# Altium schematic sheet Harness_Wrapper.SchDoc
size A4
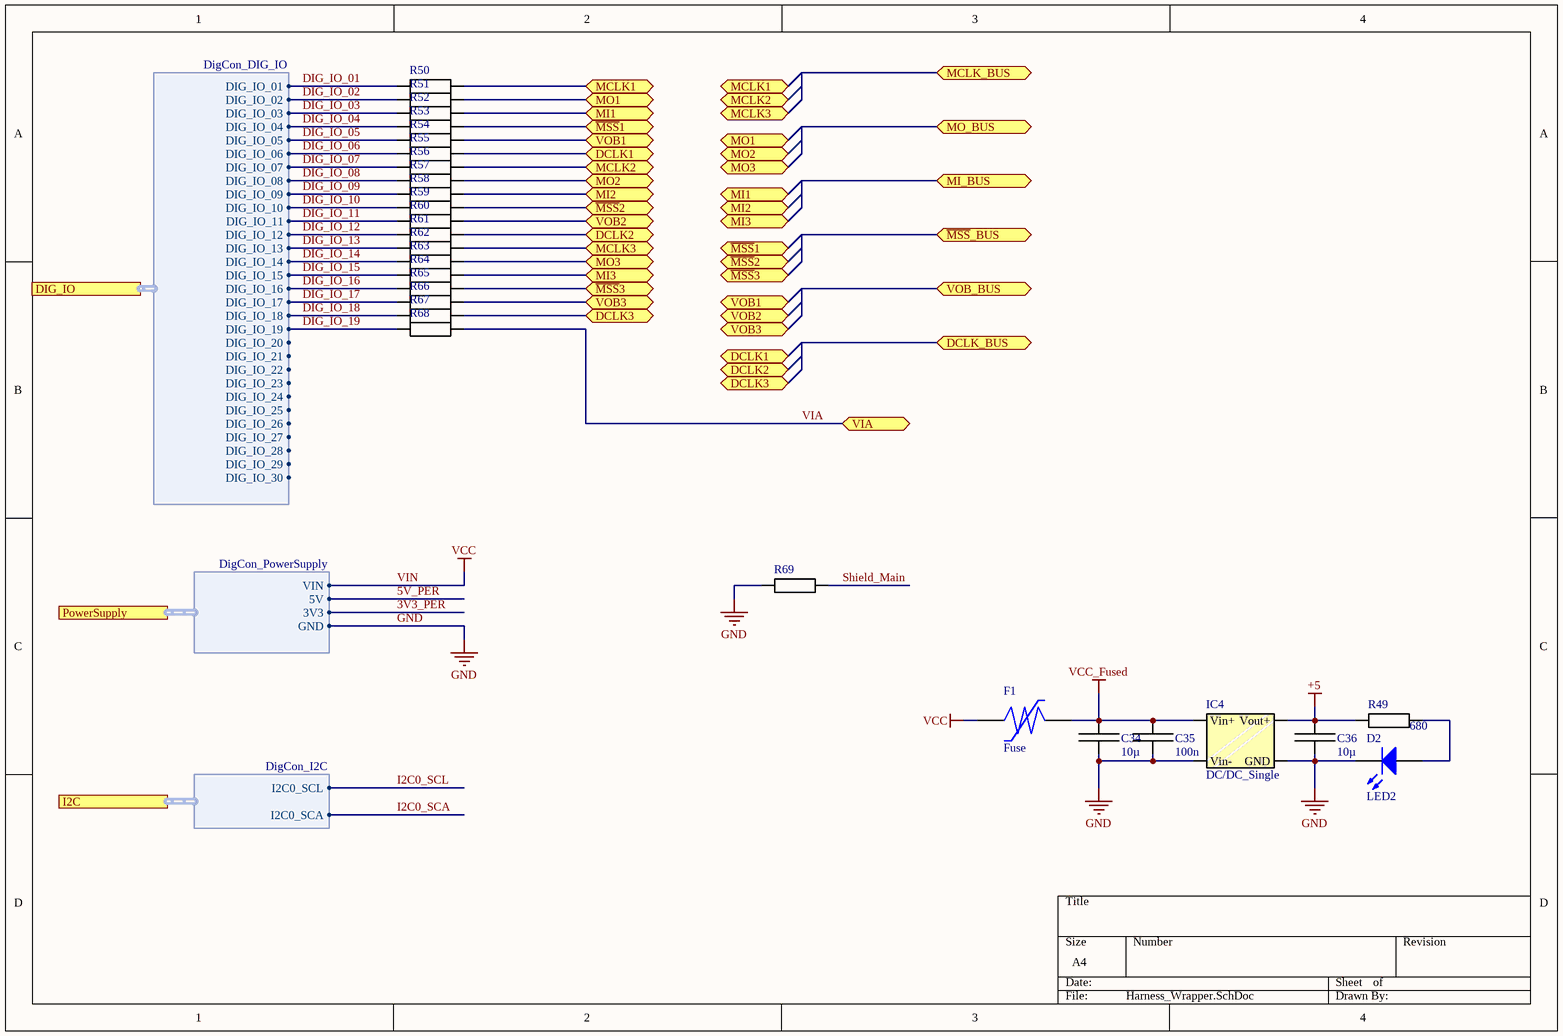
[diagram p0: Harness_Wrapper.SchDoc]

## Parts
C34  10µ  [RLC_0805]
C35  100n  [RLC_0805]
C36  10µ  [RLC_0805]
D2  LED2  [3.2X1.6X1.1]
F1  Fuse  [RLC_1812]
IC4  DC/DC_Single  [SIP4DCDC]
R49  680  [RLC_0805]
R50  100  [RLC_0805]  (value not drawn)
R51  100  [RLC_0805]  (value not drawn)
R52  100  [RLC_0805]  (value not drawn)
R53  100  [RLC_0805]  (value not drawn)
R54  100  [RLC_0805]  (value not drawn)
R55  100  [RLC_0805]  (value not drawn)
R56  100  [RLC_0805]  (value not drawn)
R57  100  [RLC_0805]  (value not drawn)
R58  100  [RLC_0805]  (value not drawn)
R59  100  [RLC_0805]  (value not drawn)
R60  100  [RLC_0805]  (value not drawn)
R61  100  [RLC_0805]  (value not drawn)
R62  100  [RLC_0805]  (value not drawn)
R63  100  [RLC_0805]  (value not drawn)
R64  100  [RLC_0805]  (value not drawn)
R65  100  [RLC_0805]  (value not drawn)
R66  100  [RLC_0805]  (value not drawn)
R67  100  [RLC_0805]  (value not drawn)
R68  100  [RLC_0805]  (value not drawn)
R69  0  [RLC_0805]  (value not drawn)

## Ports
DCLK1 (bidir), DCLK2 (bidir), DCLK3 (bidir), DCLK_BUS (bidir), DIG_IO (harness DigCon_DIG_IO), I2C (harness DigCon_I2C), MCLK1 (bidir), MCLK2 (bidir), MCLK3 (bidir), MCLK_BUS (bidir), MI1 (bidir), MI2 (bidir), MI3 (bidir), MI_BUS (bidir), MO1 (bidir), MO2 (bidir), MO3 (bidir), MO_BUS (bidir), PowerSupply (harness DigCon_PowerSupply), VIA (bidir), VOB1 (bidir), VOB2 (bidir), VOB3 (bidir), VOB_BUS (bidir), ~{MSS}1 (bidir), ~{MSS}2 (bidir), ~{MSS}3 (bidir), ~{MSS}_BUS (bidir)

## Harnesses
DigCon_DIG_IO: DIG_IO_01, DIG_IO_02, DIG_IO_03, DIG_IO_04, DIG_IO_05, DIG_IO_06, DIG_IO_07, DIG_IO_08, DIG_IO_09, DIG_IO_10, DIG_IO_11, DIG_IO_12, DIG_IO_13, DIG_IO_14, DIG_IO_15, DIG_IO_16, DIG_IO_17, DIG_IO_18, DIG_IO_19, DIG_IO_20, DIG_IO_21, DIG_IO_22, DIG_IO_23, DIG_IO_24, DIG_IO_25, DIG_IO_26, DIG_IO_27, DIG_IO_28, DIG_IO_29, DIG_IO_30
DigCon_PowerSupply: GND, 3V3, 5V, VIN
DigCon_I2C: I2C0_SCA, I2C0_SCL

## Nets
+5: C36.1 IC4.6(Vout+) R49.1
GND: C34.2 C35.2 C36.2 D2.2(K) IC4.2(Vin-) IC4.4(GND) R69.1 ; port PowerSupply.GND
VCC_Fused: C34.1 C35.1 F1.2 IC4.1(Vin+)
VIN: F1.1 ; port PowerSupply.VIN  [also labelled VCC]
3V3_PER: port PowerSupply.3V3
5V_PER: port PowerSupply.5V
DCLK1: R55.2 ; port DCLK1
DCLK2: R61.2 ; port DCLK2
DCLK3: R67.2 ; port DCLK3
DIG_IO_01: R50.1 ; port DIG_IO.DIG_IO_01
DIG_IO_02: R51.1 ; port DIG_IO.DIG_IO_02
DIG_IO_03: R52.1 ; port DIG_IO.DIG_IO_03
DIG_IO_04: R53.1 ; port DIG_IO.DIG_IO_04
DIG_IO_05: R54.1 ; port DIG_IO.DIG_IO_05
DIG_IO_06: R55.1 ; port DIG_IO.DIG_IO_06
DIG_IO_07: R56.1 ; port DIG_IO.DIG_IO_07
DIG_IO_08: R57.1 ; port DIG_IO.DIG_IO_08
DIG_IO_09: R58.1 ; port DIG_IO.DIG_IO_09
DIG_IO_10: R59.1 ; port DIG_IO.DIG_IO_10
DIG_IO_11: R60.1 ; port DIG_IO.DIG_IO_11
DIG_IO_12: R61.1 ; port DIG_IO.DIG_IO_12
DIG_IO_13: R62.1 ; port DIG_IO.DIG_IO_13
DIG_IO_14: R63.1 ; port DIG_IO.DIG_IO_14
DIG_IO_15: R64.1 ; port DIG_IO.DIG_IO_15
DIG_IO_16: R65.1 ; port DIG_IO.DIG_IO_16
DIG_IO_17: R66.1 ; port DIG_IO.DIG_IO_17
DIG_IO_18: R67.1 ; port DIG_IO.DIG_IO_18
DIG_IO_19: R68.1 ; port DIG_IO.DIG_IO_19
I2C0_SCA: port I2C.I2C0_SCA
I2C0_SCL: port I2C.I2C0_SCL
~{MSS}1: R53.2 ; port ~{MSS}1
~{MSS}2: R59.2 ; port ~{MSS}2
~{MSS}3: R65.2 ; port ~{MSS}3
MCLK1: R50.2 ; port MCLK1
MCLK2: R56.2 ; port MCLK2
MCLK3: R62.2 ; port MCLK3
MI1: R52.2 ; port MI1
MI2: R58.2 ; port MI2
MI3: R64.2 ; port MI3
MO1: R51.2 ; port MO1
MO2: R57.2 ; port MO2
MO3: R63.2 ; port MO3
Shield_Main: R69.2
VIA: R68.2 ; port VIA
VOB1: R54.2 ; port VOB1
VOB2: R60.2 ; port VOB2
VOB3: R66.2 ; port VOB3
NetD2_1: D2.1(A) R49.2

## Library data of the parts
C34-C36 = C
D2 = LED2: Typical RED, GREEN, YELLOW, AMBER GaAs LED; Published: 8-Jun-2000; LatestRevisionDate: 17-Jul-2002; LatestRevisionNote: Re-released for DXP Platform.; PackageVersion: Feb-2002; PackageReference: 3.2X1.6X1.1; Publisher: Altium Limited; PackageDescription: SM LED; 2 Flat Leads
IC4 = DC/DC_Single: pin to pad: 1>2 2>1 4>3 6>4
R49-R69 = R